# EasyEDA Pro project FKM3.epro, board OLD_LAYOUT
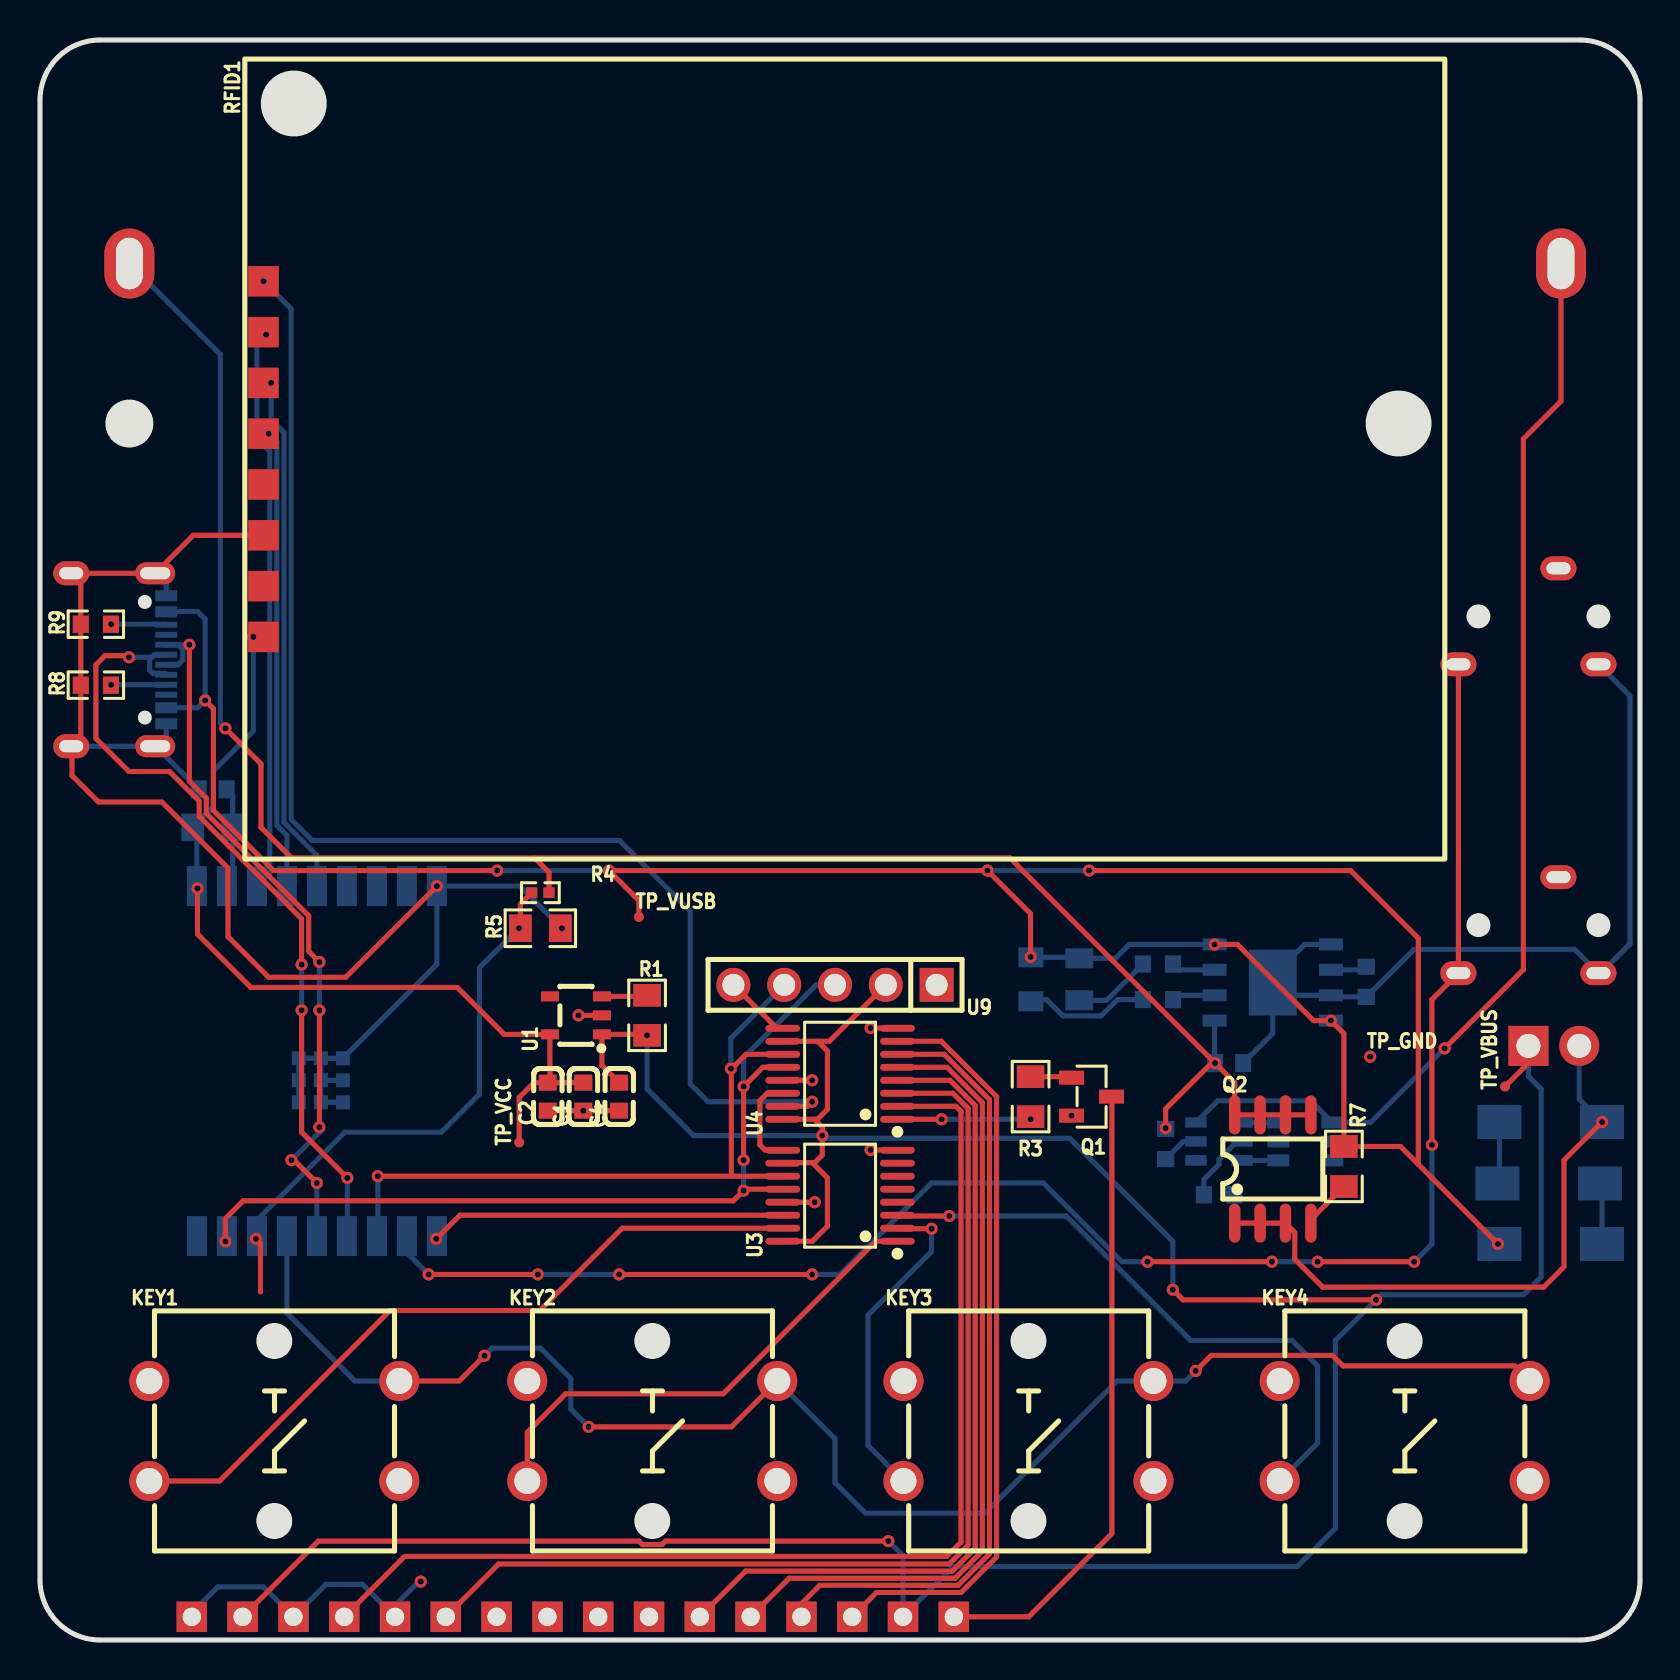
[diagram p11: board, top side]
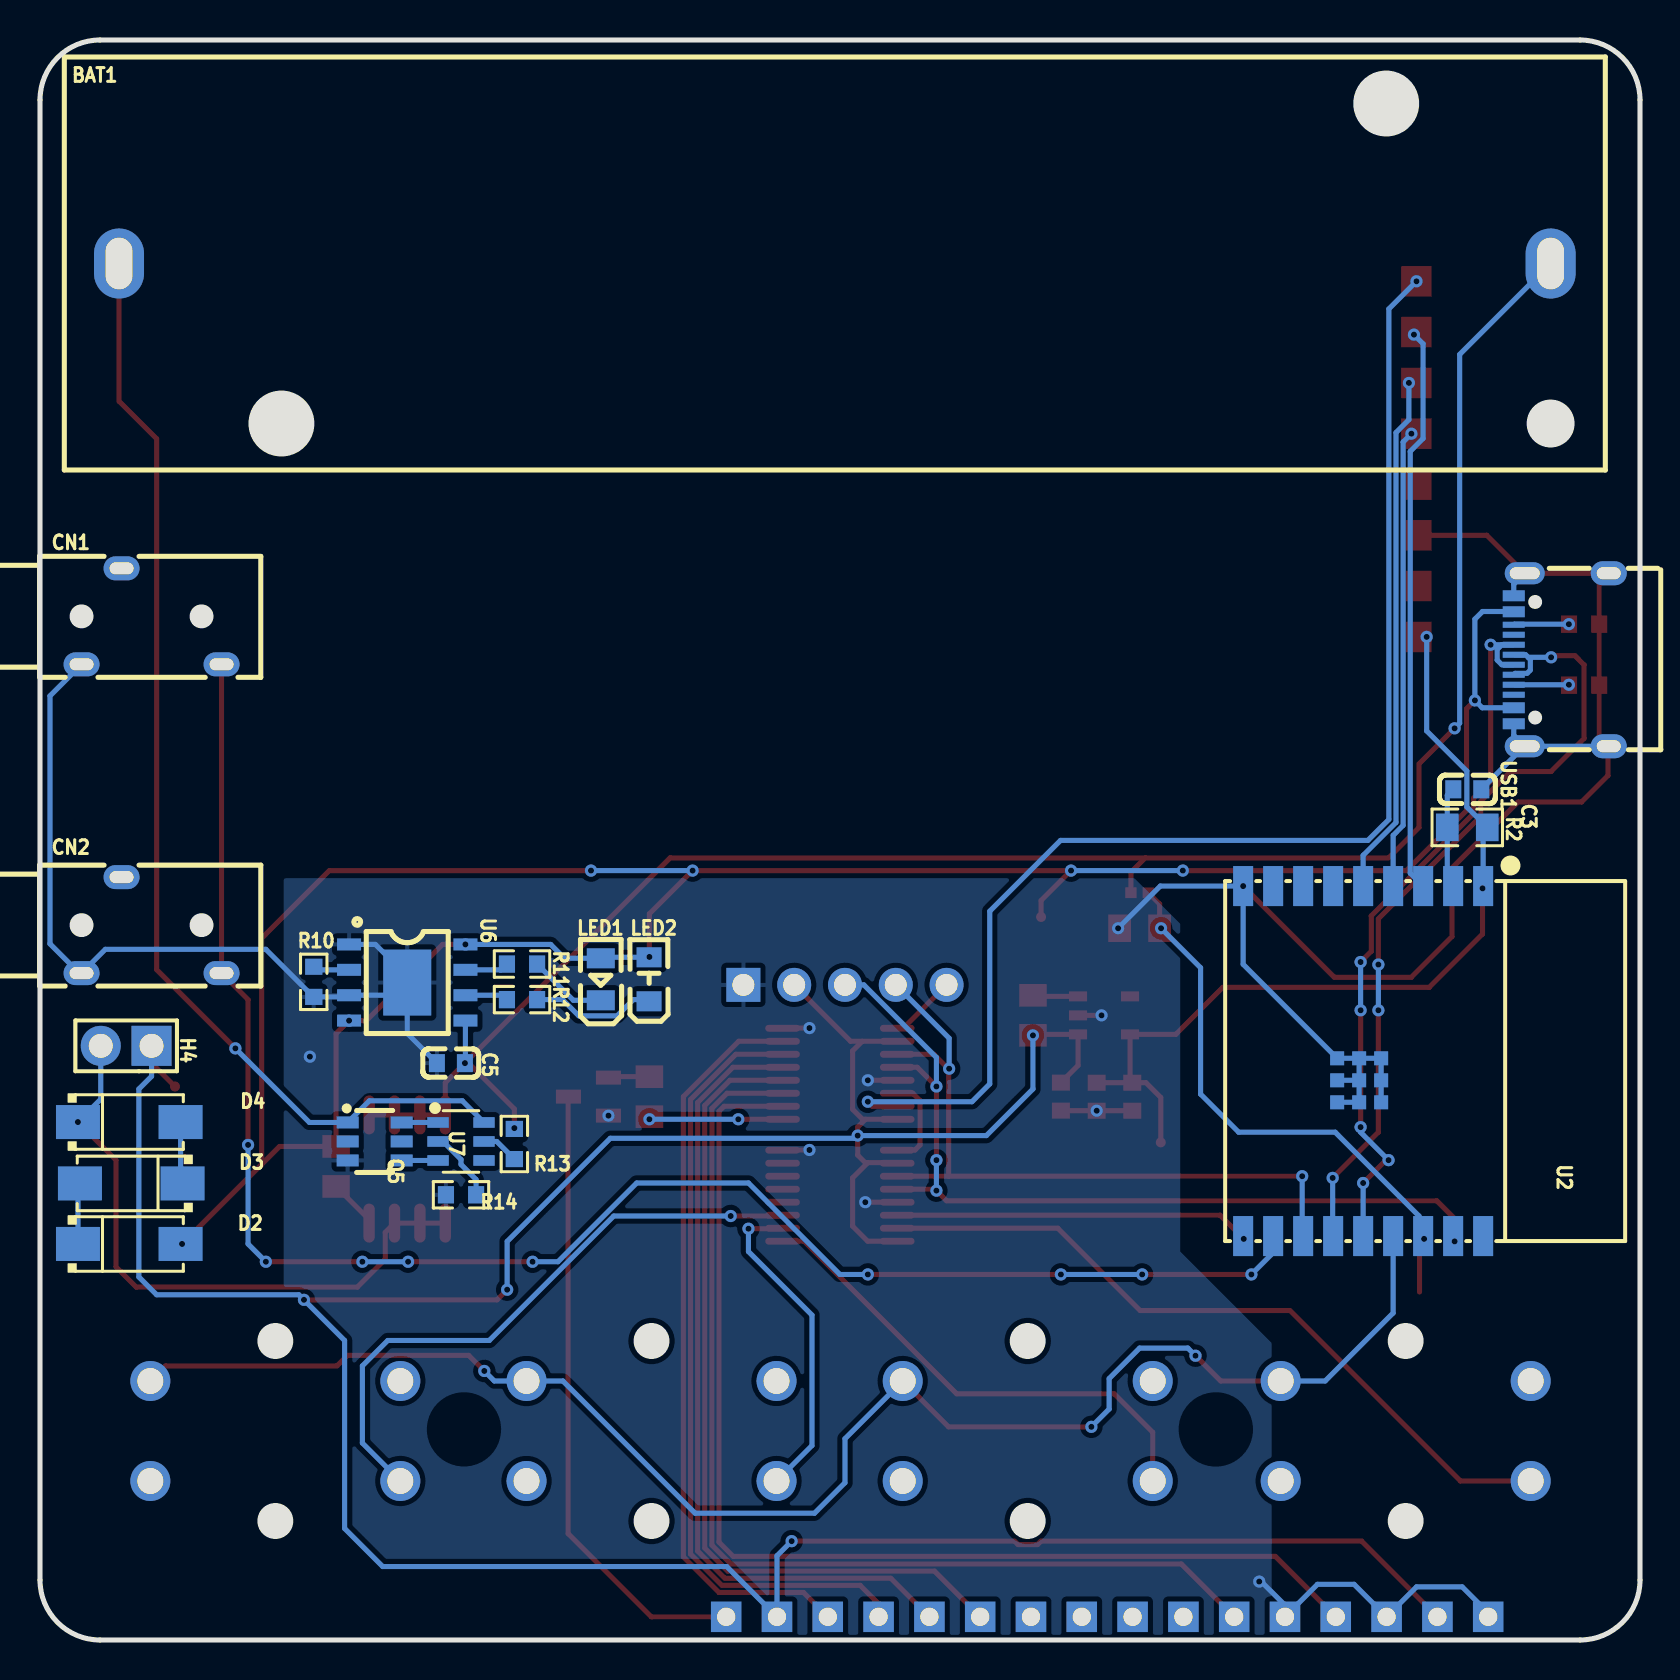
[diagram p12: board, bottom side, seen from below]

Outline 80 x 80 mm; copper layers: Top Layer, Bottom Layer. Coordinates in mm from the lower left corner of the outline.
Outline path: 0,77 0,3 arc(0.88,0.88) 3,0 77,0 arc(79.12,0.88) 80,3 80,77 arc(79.12,79.12) 77,80 3,80 arc(0.88,79.12) 0,77
Stack: Top Layer 0.035mm / Dielectric1 1.51mm FR4 er 4.5 / Bottom Layer 0.035mm

## Design rules (mm)
template: JLCPCB Capability(Two Layers Board)
spacing copperThickness1oz (default): track to track 0.102, other pairs 0.152 to 0.3
spacing copperThickness2oz: track to track 0.203, other pairs 0.152 to 0.3
track width copperThickness1oz (default): min 0.127, default 0.254, max 2.54
track width copperThickness2oz: min 0.203, default 0.254, max 2.54
differential pair differentialPair (default): width min 0.127, default 0.254, max 2.54; gap min 0.152, default 0.152
via viaSize (default): diameter min 0.5, default 0.61, max 10; hole min 0.3, default 0.305, max 6.3

## Placement (name value [footprint] x y rotation side)
BAT1  BH-18650-A6AJ003  [BAT-TH_BH-18650-A5BJ003]  40.26 68.82 180 bottom
C1  10uF  [C0603]  27.17 27.17 270 top
C2  100nF  [C0603]  25.39 27.17 270 top
C3  1uF  [C0603]  8.64 42.54 0 bottom
C4  10uF  [C0603]  28.96 27.17 270 top
C5  10uF  [C0603]  59.45 28.84 180 bottom
CN1  PJ-3200  [AUDIO-TH_PJ-3200]  74.42 51.18 180 bottom
CN2  PJ-3200  [AUDIO-TH_PJ-3200]  74.42 35.74 180 bottom
D2  SS14  [SMA_L4.2-W2.6-LS5.3-RD]  75.54 19.8 180 bottom
D3  SS14  [SMA_L4.2-W2.6-LS5.3-RD]  75.44 22.83 0 bottom
D4  SS14  [SMA_L4.2-W2.6-LS5.3-RD]  75.54 25.9 180 bottom
H1  -  [LCD16x2 edge connector]  7.59 1.16 0 top
H4  PW SWITCH  [HDR-TH_2P-P2.54-V-M]  75.69 29.71 0 bottom
KEY1  B3F-4055  [KEY-TH_4P-L12.0-W12.0-P5.00-LS13.4-EH]  11.72 10.45 0 top
KEY2  B3F-4055  [KEY-TH_4P-L12.0-W12.0-P5.00-LS13.4-EH]  30.61 10.45 0 top
KEY3  B3F-4055  [KEY-TH_4P-L12.0-W12.0-P5.00-LS13.4-EH]  49.42 10.45 0 top
KEY4  B3F-4055  [KEY-TH_4P-L12.0-W12.0-P5.00-LS13.4-EH]  68.23 10.45 0 top
LED1  KT-0805G  [LED0805-R-RD]  51.96 33.04 90 bottom
LED2  LTST-C170TBKT  [LED0805-RD_BLUE]  49.55 33.04 90 bottom
Q1  MMBT3904  [SOT-23-3_L2.9-W1.3-P1.90-LS2.4-BR]  52.58 27.17 180 top
Q2  AOSP21321  [SOIC-8_L5.0-W4.0-P1.27-LS6.0-BL]  61.64 23.55 0 top
Q5  FS8205A  [SOT-23-6_L2.9-W1.6-P0.95-LS2.8-BR]  63.27 24.93 0 bottom
R1  10kΩ  [R0805]  30.35 31.23 270 top
R2  10kΩ  [R0805]  8.64 40.63 0 bottom
R3  10kΩ  [R0805]  49.53 27.17 90 top
R4  6.8kΩ  [R0402]  25.02 37.37 180 top
R5  10kΩ  [R0805]  25.02 35.59 0 top
R7  10kΩ  [R0805]  65.2 23.68 270 top
R8  5100  [R0603]  2.79 47.74 0 top
R9  5100  [R0603]  2.79 50.79 0 top
R10  1.2k  [R0603]  66.31 32.91 270 bottom
R11  1k  [R0603]  55.9 33.8 0 bottom
R12  1k  [R0603]  55.9 32.02 0 bottom
R13  100  [R0603]  56.28 24.8 90 bottom
R14  1k  [R0603]  58.95 22.26 180 bottom
RFID1  -  [RFID-RC522-Board]  15.49 20.56 0 top
TP_GND  -  [Test-Point-0.5mm]  66.51 29.17 0 top
TP_VBUS  -  [Test-Point-0.5mm]  73.25 27.68 90 top
TP_VCC  -  [Test-Point-0.5mm]  23.96 24.88 90 top
TP_VUSB  -  [Test-Point-0.5mm]  29.95 36.15 0 top
U1  AP7366-33W5-7  [SOT-25_L3.0-W1.6-P0.95-LS2.8-BL]  26.8 31.23 90 top
U2  2.4GHz  [BULETM-SMD_ESPRESSIF_ESP32-C3-WROOM-02-N4-4MB]  13.84 28.95 270 bottom
U3  74HC595PW,118  [TSSOP-16_L5.0-W4.4-P0.65-LS6.4-BL]  40.01 22.22 90 top
U4  74HC595PW,118  [TSSOP-16_L5.0-W4.4-P0.65-LS6.4-BL]  40.01 28.31 90 top
U6  TP4056  [ESOP-8_L4.9-W3.9-P1.27-LS6.0-BL-EP]  61.64 32.87 270 bottom
U7  DW01A  [SOT-23-6_L2.9-W1.6-P0.95-LS2.8-BL]  58.95 24.93 270 bottom
U9  HB-PH3-25415PB2GOP  [HDR-TH_5P-P2.54-V-M]  39.75 32.76 180 top
USB1  TYPE-C 16PIN 2MD(073)  [USB-C-SMD_TYPE-C-6PIN-2MD-073]  3.94 49.01 90 bottom

## Footprints (pads in the part's own frame, mm; a bottom-side part is the same pattern mirrored in y, then rotated)
AUDIO-TH_PJ-3200
  oval 1.8x1.2 hole 1.2x0.6: 2(-1.5,2.4) 3(-3.5,-2.4) 4(3.5,-2.4)
BAT-TH_BH-18650-A5BJ003
  oval 2.5x3.5 hole 1.34x2.58: 1(-35.79,0) 2(35.79,0)
BULETM-SMD_ESPRESSIF_ESP32-C3-WROOM-02-N4-4MB
  rect 2x1 smd: 1(-8.75,6) 2(-8.75,4.5) 3(-8.75,3) 4(-8.75,1.5) 5(-8.75,0) 6(-8.75,-1.5) 7(-8.75,-3) 8(-8.75,-4.5) 9(-8.75,-6) 10(8.75,-6) 11(8.75,-4.5) 12(8.75,-3) 13(8.75,-1.5) 14(8.75,0) 15(8.75,1.5) 16(8.75,3) 17(8.75,4.5) 18(8.75,6)
  rect 0.7x0.7 smd: 19(-0.14,-1.3) 19(-0.14,-0.2) 19(-0.14,0.9) 19(0.96,-1.3) 19(0.96,-0.2) 19(0.96,0.9) 19(2.06,-1.3) 19(2.06,-0.2) 19(2.06,0.9)
C0603
  rect 0.8x0.9 smd: 1(-0.7,0) 2(0.7,0)
ESOP-8_L4.9-W3.9-P1.27-LS6.0-BL-EP
  rect 0.6x1.2 smd: 1(-1.905,-2.909) 2(-0.635,-2.909) 3(0.635,-2.909) 4(1.905,-2.909) 5(1.905,2.909) 6(0.635,2.909) 7(-0.635,2.909) 8(-1.905,2.909)
  rect 3.3x2.4 smd: 9(0,0)
HDR-TH_2P-P2.54-V-M
  rect 2x2 hole 1.2: 1(-1.27,0)
  round 2 hole 1.2: 2(1.27,0)
HDR-TH_5P-P2.54-V-M
  rect 1.7x1.7 hole 1.1: 1(-5.08,0)
  round 1.7 hole 1.1: 2(-2.54,0) 3(0,0) 4(2.54,0) 5(5.08,0)
KEY-TH_4P-L12.0-W12.0-P5.00-LS13.4-EH
  round 2 hole 1.3: 1(6.25,-2.5) 2(-6.25,-2.5) 3(6.25,2.5) 4(-6.25,2.5)
LCD16x2 edge connector
  rect 1.524x1.524 hole 0.914x0.914: 1(0,0) 3(5.08,0) 4(7.62,0) 5(10.16,0) 6(12.7,0) 7(15.24,0) 8(17.78,0) 9(20.32,0) 10(22.86,0) 11(25.4,0) 12(27.94,0) 13(30.48,0) 14(33.02,0) 15(35.56,0) 16(38.1,0)
  rect 1.524x1.524 hole 0.914x1: 2(2.54,0)
LED0805-R-RD
  rect 1x1.399 smd: 1(1.05,0) 2(-1.05,0)
LED0805-RD_BLUE
  rect 1x1.25 smd: 1(-1.1,0) 2(1.1,0)
R0402
  rect 0.566x0.54 smd: 1(-0.433,0) 2(0.433,0)
R0603
  rect 0.806x0.864 smd: 1(-0.753,0) 2(0.753,0)
R0805
  rect 1.133x1.377 smd: 1(-1,0) 2(1,0)
RFID-RC522-Board
  rect 1.524x1.524 smd: 1(-4.318,47.371) 2(-4.318,44.831) 3(-4.318,42.291) 4(-4.318,39.751) 5(-4.318,37.211) 6(-4.318,34.671) 7(-4.318,32.131) 8(-4.318,29.591)
SMA_L4.2-W2.6-LS5.3-RD
  rect 2.2x1.7 smd: 1(-2.566,0) 2(2.566,0)
SOIC-8_L5.0-W4.0-P1.27-LS6.0-BL
  oval 0.569x1.95 smd: 1(-1.905,-2.705) 2(-0.635,-2.705) 3(0.635,-2.705) 4(1.905,-2.705) 5(1.905,2.705) 6(0.635,2.705) 7(-0.635,2.705) 8(-1.905,2.705)
SOT-23-3_L2.9-W1.3-P1.90-LS2.4-BR
  rect 1.25x0.7 smd: 1(1,-0.95) 2(1,0.95) 3(-1,0)
SOT-23-6_L2.9-W1.6-P0.95-LS2.8-BL
  rect 0.532x1.072 smd: 1(-0.95,-1.149) 2(0,-1.149) 3(0.95,-1.149) 4(0.95,1.149) 5(0,1.149) 6(-0.95,1.149)
SOT-23-6_L2.9-W1.6-P0.95-LS2.8-BR
  rect 1.1x0.6 smd: 1(1.35,-0.95) 2(1.35,0) 3(1.35,0.95) 4(-1.35,0.95) 5(-1.35,0) 6(-1.35,-0.95)
SOT-25_L3.0-W1.6-P0.95-LS2.8-BL
  rect 0.5x0.9 smd: 1(-0.95,-1.3) 2(0,-1.3) 3(0.95,-1.3) 4(0.95,1.3) 5(-0.95,1.3)
Test-Point-0.5mm
  round 0.5 smd: 1(0,0)
TSSOP-16_L5.0-W4.4-P0.65-LS6.4-BL
  oval 0.343x1.732 smd: 1(-2.275,-2.866) 2(-1.625,-2.866) 3(-0.975,-2.866) 4(-0.325,-2.866) 5(0.325,-2.866) 6(0.975,-2.866) 7(1.625,-2.866) 8(2.275,-2.866) 9(2.275,2.866) 10(1.625,2.866) 11(0.975,2.866) 12(0.325,2.866) 13(-0.325,2.866) 14(-0.975,2.866) 15(-1.625,2.866) 16(-2.275,2.866)
USB-C-SMD_TYPE-C-6PIN-2MD-073
  rect 0.55x1.1 smd: 1(-3.2,2.375) 2(-2.4,2.375) 11(2.4,2.375) 12(3.2,2.375)
  rect 0.3x1.1 smd: 3(-1.75,2.375) 4(-1.25,2.375) 5(-0.75,2.375) 6(-0.25,2.375) 7(0.25,2.375) 8(0.75,2.375) 9(1.25,2.375) 10(1.75,2.375)
  oval 1.2x1.8 hole 0.6x1.2: 13(-4.325,-2.375) 14(4.325,-2.375)
  oval 1.1x2 hole 0.6x1.5: 13(-4.325,1.825) 14(4.325,1.825)

## Nets
GND: C1.2 C2.2 C3.1 C4.2 C5.1 CN1.3 CN2.3 H1.1 H1.3 H1.5 Q1.2 Q5.3 R5.2 R8.1 R9.1 R10.2 R14.1 RFID1.6 TP_GND.1 U1.2 U2.9 U2.19 U3.8 U3.13 U4.8 U4.13 U6.1 U6.3 U6.9 U9.1 USB1.1 USB1.12 USB1.13 USB1.14
VBUS: C4.1 H1.2 H1.15 H4.1 R1.2 TP_VBUS.1 U1.1 U3.10 U3.16 U4.10 U4.16 U9.2
VCC: C1.1 C2.1 R2.1 RFID1.8 TP_VCC.1 U1.5 U2.1
B+: BAT1.2 C5.2 Q2.5 Q2.6 Q2.7 Q2.8 R4.1 R13.2 U6.5
B-: BAT1.1 Q5.1 U7.6
BAT_SENS: R4.2 R5.1 U2.16
BTN_1: KEY1.2 U3.15
BTN_2: KEY2.2 U3.1
BTN_3: KEY3.2 U3.2
BTN_4: KEY4.2 U3.3
BTN_INP: KEY1.3 KEY2.3 KEY3.3 KEY4.3 U2.15
JACK: CN1.4 CN2.4 U2.11
LCD_BL: R3.1 U4.1
LCD_D4: H1.11 U4.4
LCD_D5: H1.12 U4.5
LCD_D6: H1.13 U4.6
LCD_D7: H1.14 U4.7
LCD_E: H1.6 U4.3
LCD_RS: H1.4 U4.2
S_DS: U2.10 U3.14
S_OUT: U4.9 U9.5
S_SHCP: U2.12 U3.11 U4.11 U9.4
S_STCP: U2.17 U3.12 U4.12 U9.3
SPI_CS: RFID1.1 U4.15
SPI_MISO: RFID1.4 U2.4
SPI_MOSI: RFID1.3 U2.5
SPI_SCK: RFID1.2 U2.3
USB_D+: U2.14 USB1.6 USB1.8
USB_D-: U2.13 USB1.5 USB1.7
VUSB: D2.2 LED1.1 LED2.2 R7.1 TP_VUSB.1 U6.4 U6.8 USB1.2 USB1.11
$1N383: R1.1 U1.3
$1N953: C3.2 R2.2 U2.2
$1N7305: U3.9 U4.14
$2N3153: Q1.1 R3.2
$2N3159: H1.16 Q1.3
$3N541: D4.1 H4.2 Q2.1 Q2.2 Q2.3
$3N542: Q2.4 R7.2
$3N546: D2.1 D3.2
$3N547: D3.1 D4.2
$3N796: R9.2 USB1.10
$3N800: R8.2 USB1.4
$3N1470: R13.1 U7.5
$3N1480: R11.2 U6.7
$3N1483: R12.2 U6.6
$3N1491: R10.1 U6.2
$3N1585: R14.2 U7.2
$3N1604: Q5.4 U7.3
$3N1608: Q5.6 U7.1
$3N3082: LED1.2 R11.1
$3N3173: LED2.1 R12.1

Pads without a net: CN1 2; CN2 2; H1 7 8 9 10; KEY1 1 4; KEY2 1 4; KEY3 1 4; KEY4 1 4; Q5 2 5; RFID1 5 7; U1 4; U2 6 7 8 18; U3 4 5 6 7; U7 4; USB1 3 9

## Via types
v1: diameter 0.61, hole 0.305, Top Layer to Bottom Layer, 74 vias

## Routing (per net, layer and track width the routed paths; a pad name or vN(x,y) marks a point on that pad's centre or on a via; arc(x,y) is an arc through that point)
GND: length 152.5
  Top Layer w0.254: U4.13 v1(38.61,27.99) ; v1(19.84,37.7) 15.28,33.14 11.43,33.14 9.4,35.17 9.4,38.6 6.1,41.9 2.92,41.9 1.6,43.22 1.6,44.65 USB1.13 2.04,45.17 R8.1 R9.1 2.04,52.86 USB1.14 USB1.14 7.66,55.24 10.8,55.24 ; U3.8 42.86,24.5 v1(41.53,24.5) ; v1(41.53,30.6) 42.86,30.6 U4.8 ; C2.2 v1(27.17,26.47) 28.95,26.47 C4.2 ; 28.1,31.23 v1(26.92,31.23) ; U3.13 v1(38.73,21.89)
  Bottom Layer w0.254: U2.19 U2.19 U2.19 ; C5.1 61.64,30.33 U6.9 ; U2.19 U2.19 19.84,33.79 v1(19.84,37.7) 23.99,37.7 v1(26.09,35.59) ; U2.19 U2.19 U2.19 U2.19 ; U2.19 U2.19 ; U6.1 63.23,34.78 61.64,33.19 U6.9 ; USB1.13 5.78,44.69 C3.1 ; USB1.13 USB1.13 ; USB1.13 6.31,45.24 USB1.1 ; USB1.14 6.31,52.79 USB1.12 ; 77.92,48.78 79.5,47.2 79.5,34.81 78.04,33.34 CN2.3 76.73,34.53 68.71,34.53 66.29,32.12 ; U6.9 62.27,32.24 U6.3 64.63,32.16 R10.2 ; H1.1 7.59,1.36 8.89,2.66 11.17,2.66 H1.3 14.3,2.78 16.13,2.78 17.75,1.16 17.75,1.74 18.92,2.91 19.03,2.91 v1(19.04,2.92) ; U2.19 U2.19
  vias: v1(51.58,26.22) v1(66.51,29.17)
VBUS: length 168.8
  Top Layer w0.254: U3.10 37.17,23.87 38.61,23.87 ; 38.72,26.04 39.12,25.64 v1(39.12,25.22) 39.12,24.25 38.73,23.87 38.61,23.87 ; 38.72,26.04 U4.16 ; 38.72,26.04 38.87,26.04 39.37,26.53 39.37,29.45 38.89,29.94 ; 38.61,23.87 39.37,23.1 39.37,20.69 38.62,19.94 U3.16 ; v1(42.42,4.94) 31.27,4.94 31.1,4.77 30.13,4.77 29.95,4.94 13.92,4.94 H1.2 ; TP_VBUS.1 74.42,28.84 H4.1 ; C4.1 28.1,28.73 28.1,30.28 29.8,30.28 29.85,30.23 ; 42.29,32.76 39.47,29.94 38.89,29.94 ; 38.89,29.94 U4.10 ; v1(66.8,17.01) 57.15,17.01 v1(56.64,17.52)
  Bottom Layer w0.254: v1(30.35,30.23) 30.35,27.55 32.68,25.22 v1(39.12,25.22) 39.25,25.09 51.49,25.09 56.64,19.93 v1(56.64,17.52) ; v1(42.42,4.94) 43.15,4.21 H1.15 45.67,3.67 62.86,3.67 64.77,5.58 64.77,14.98 v1(66.8,17.01) 67.06,17.26 74.17,17.26 75.06,18.15 75.06,27.55 74.42,28.18 H4.1
VCC: length 44.1
  Top Layer w0.254: C2.1 C1.1 ; C2.1 25.5,27.97 U1.5 23.21,30.28 20.86,32.63 10.54,32.63 7.87,35.3 v1(7.87,37.58) ; C2.1 24.7,27.87 23.96,27.13 TP_VCC.1
  Bottom Layer w0.254: v1(10.67,50.16) 10.67,45.46 8.66,43.45 8.66,41.65 R2.1 7.84,40.42 7.84,37.57
B+: length 98.9
  Top Layer w0.254: 24.73,39.11 25.45,38.39 R4.1 ; 24.73,39.11 12.57,39.11 11.05,40.63 11.05,43.81 v1(9.27,45.58) ; 24.73,39.11 48.49,39.11 v1(58.75,28.84) ; v1(56.28,25.6) 56.28,26.55 58.57,28.84 v1(58.75,28.84) ; Q2.5 Q2.6 Q2.7 Q2.8 59.73,27.86 v1(58.75,28.84)
  Bottom Layer w0.254: U6.5 58.73,28.87 v1(58.75,28.84) ; BAT1.2 9.02,64.28 9.02,45.84 v1(9.27,45.58)
B-: length 56.5
  Top Layer w0.254: BAT1.1 76.05,61.94 74.17,60.06 74.17,33.52 v1(70.23,29.58)
  Bottom Layer w0.254: v1(70.23,29.58) 66.53,25.88 Q5.1 63.54,26.96 58.88,26.96 U7.6
BAT_SENS: length 28.4
  Top Layer w0.254: R4.2 24.02,36.8 R5.1 ; 11.02,17.4 11.02,19.83 v1(10.8,20.06)
  Bottom Layer w0.254: v1(23.95,35.59) 21.97,33.61 21.97,27.3 20.07,25.39 15.24,25.39 11.05,21.2 11.05,20.4 U2.16
BTN_1: length 36.9
  Top Layer w0.254: KEY1.2 8.98,7.95 17.5,16.47 24.99,16.47 29.11,20.59 U3.15
BTN_2: length 24.9
  Top Layer w0.254: U3.1 41.79,19.94 34.16,12.31 26.29,12.31 24.36,10.38 KEY2.2
BTN_3: length 16.4
  Top Layer w0.254: v1(44.58,20.56) 42.9,20.56 U3.2
  Bottom Layer w0.254: KEY3.2 41.4,9.72 41.4,16.25 44.58,19.42 v1(44.58,20.56)
BTN_4: length 30.7
  Top Layer w0.254: U3.3 42.91,21.2 v1(45.47,21.2)
  Bottom Layer w0.254: v1(45.47,21.2) 51.31,21.2 57.54,14.98 62.61,14.98 63.88,13.71 63.88,9.85 KEY4.2
BTN_INP: length 79.2
  Top Layer w0.254: v1(22.23,14.21) 20.96,12.95 KEY1.3 ; v1(27.43,10.66) 34.57,10.66 KEY2.3 ; KEY4.3 73.73,13.71 65.15,13.71 64.63,14.23 58.56,14.23 v1(57.79,13.45)
  Bottom Layer w0.254: v1(57.79,13.45) 57.28,12.95 KEY3.3 53.85,12.95 47.24,6.34 41.27,6.34 39.75,7.86 39.75,10.06 KEY2.3 ; v1(27.43,10.66) 26.54,11.55 26.54,13.07 25.02,14.59 22.61,14.59 v1(22.23,14.21) ; KEY1.3 15.74,12.95 12.34,16.35 12.34,20.07
JACK: length 86
  Top Layer w0.254: v1(69.6,24.76) 69.6,32.02 CN2.4 70.92,48.78 ; v1(19.43,18.28) v1(24.89,18.28) ; v1(68.71,18.91) v1(63.88,18.91) ; v1(61.6,18.91) v1(55.37,18.91) ; v1(28.96,18.28) v1(38.61,18.28)
  Bottom Layer w0.254: v1(63.88,18.91) v1(61.6,18.91) ; v1(55.37,18.91) 54.1,18.91 50.17,22.85 44.58,22.85 40.01,18.28 v1(38.61,18.28) ; v1(19.43,18.28) 18.34,19.37 U2.11 ; v1(69.6,24.76) 69.6,19.8 v1(68.71,18.91) ; v1(24.89,18.28) v1(28.96,18.28)
LCD_BL: length 6.7
  Top Layer w0.254: U4.1 v1(45.08,26.04)
  Bottom Layer w0.254: v1(45.08,26.04) v1(49.53,26.04)
LCD_D4: length 41.7
  Top Layer w0.254: U4.4 45.5,27.99 46.76,26.73 46.76,4.6 45.61,3.44 35.28,3.44 H1.11
LCD_D5: length 40.4
  Top Layer w0.254: H1.12 37.46,3.09 45.76,3.09 47.12,4.45 47.12,26.87 45.36,28.64 U4.5
LCD_D6: length 39.3
  Top Layer w0.254: U4.6 45.21,29.29 47.47,27.02 47.47,4.3 45.9,2.73 38.99,2.73 38.07,1.81 H1.13
LCD_D7: length 37.6
  Top Layer w0.254: H1.14 41.83,2.38 46.05,2.38 47.83,4.15 47.83,27.17 45.06,29.94 U4.7
LCD_E: length 53.3
  Top Layer w0.254: H1.6 22.93,3.8 45.46,3.8 46.41,4.74 46.41,26.58 45.65,27.34 U4.3
LCD_RS: length 57.2
  Top Layer w0.254: H1.4 18.23,4.18 45.34,4.18 46.05,4.89 46.05,26.43 45.8,26.69 U4.2
S_DS: length 17.8
  Top Layer w0.254: v1(19.81,20.06) 21,21.24 U3.14
S_OUT: length 3.4
  Top Layer w0.254: 34.67,32.76 36.84,30.59 U4.9
S_SHCP: length 36.9
  Top Layer w0.254: 34.57,23.19 v1(16.89,23.19) ; 34.57,23.19 37.14,23.19 ; 34.57,23.19 34.57,28.55 35.31,29.29 U4.11
  Bottom Layer w0.254: v1(16.89,23.19) 16.89,20.12 16.84,20.07 ; v1(34.54,28.57) 34.54,30.09 U9.4
S_STCP: length 44.7
  Top Layer w0.254: U4.12 36.14,28.64 v1(35.18,27.68) v1(35.18,23.99) ; v1(9.27,19.93) 9.27,21.07 10.16,21.96 34.67,21.96 v1(35.18,22.47) 35.25,22.54 U3.12
  Bottom Layer w0.254: U9.3 38.81,32.76 35.18,29.13 v1(35.18,27.68) ; v1(35.18,23.99) v1(35.18,22.47)
SPI_CS: length 66
  Top Layer w0.254: v1(38.61,26.91) 38.38,26.69 U4.15
  Bottom Layer w0.254: v1(38.61,26.91) 33.4,26.91 32.51,27.8 32.51,36.44 28.97,39.98 13.61,39.98 12.56,41.03 12.56,66.55 v1(11.18,67.94)
SPI_MISO: length 23
  Bottom Layer w0.254: v1(11.43,60.32) 11.84,59.9 11.84,40.73 12.34,40.23 U2.4
SPI_MOSI: length 26.1
  Bottom Layer w0.254: U2.5 13.84,39.23 12.2,40.88 12.2,60.37 11.56,61.02 v1(11.56,62.86)
SPI_SCK: length 28.3
  Bottom Layer w0.254: v1(11.3,65.27) 10.85,64.81 10.85,60.07 11.49,59.43 11.49,38.34 U2.3
USB_D+: length 37
  Top Layer w0.254: v1(13.97,31.49) v1(13.97,25.64) ; v1(7.47,49.76) 7.47,42.94 8.32,42.09 8.32,41.33 13.44,36.21 13.44,34.43 v1(13.97,33.9) ; v1(13.84,22.85) 12.7,23.99 v1(12.57,23.99)
  Bottom Layer w0.254: 6.91,49.76 6.89,49.77 6.32,49.77 USB1.8 6.91,49.76 ; 6.91,49.76 v1(7.47,49.76) ; 6.91,49.76 7.14,49.53 7.14,49 6.91,48.76 USB1.6 ; v1(13.97,33.9) v1(13.97,31.49) ; v1(13.97,25.64) 13.97,25.39 v1(12.57,23.99) ; v1(13.84,22.85) U2.14
USB_D-: length 40.4
  Top Layer w0.254: v1(15.37,23.1) 13.08,25.39 v1(13.08,31.49) ; v1(13.08,33.77) 13.08,36.06 7.96,41.18 7.96,41.94 6.48,43.42 4.45,43.42 2.79,45.08 2.79,48.76 3.25,49.22 4.37,49.22 v1(4.45,49.14)
  Bottom Layer w0.254: U2.13 15.37,20.22 v1(15.37,23.1) ; 5.59,49.14 v1(4.45,49.14) ; 5.59,49.14 5.48,49.03 5.48,48.5 5.65,48.33 6.24,48.33 USB1.5 ; 5.59,49.14 5.72,49.26 USB1.7 ; v1(13.08,33.77) v1(13.08,31.49)
VUSB: length 129.5
  Top Layer w0.254: v1(8.26,46.98) 8.67,46.56 8.67,41.47 11.67,38.47 v1(22.86,38.47) ; v1(49.53,34.15) 49.53,36.31 v1(47.37,38.47) v1(28.45,38.47) 29.95,36.97 TP_VUSB.1 ; v1(58.73,34.78) 59.87,34.78 63.68,30.97 v1(64.55,30.97) 65.2,30.32 R7.1 68.02,24.68 68.91,23.79 ; 68.91,23.79 68.91,35.09 65.53,38.47 v1(52.45,38.47) ; 68.91,23.79 v1(72.9,19.8)
  Bottom Layer w0.254: v1(22.86,38.47) v1(28.45,38.47) ; v1(58.73,34.78) 54.47,34.78 53.77,34.09 LED1.1 51.91,34.14 LED2.2 ; USB1.11 6.33,51.43 7.87,51.43 8.26,51.04 v1(8.26,46.98) 7.89,46.61 USB1.2 ; v1(47.37,38.47) v1(52.45,38.47)
$1N383: length 1.8
  Top Layer w0.254: 28.1,32.18 29.8,32.18 29.85,32.23
$1N953: length 5.2
  Bottom Layer w0.254: C3.2 9.64,42.24 R2.2 9.64,37.86 9.34,37.57
$1N7305: length 4.8
  Top Layer w0.254: U3.9 37.13,24.5 36.25,24.5 35.99,24.75 35.99,26.97 36.36,27.34 U4.14
$2N3153: length 2.1
  Top Layer w0.254: Q1.1 51.53,28.17 R3.2
$2N3159: length 31.5
  Top Layer w0.254: H1.16 49.43,1.16 53.59,5.32 53.59,27.15 Q1.3
$3N541: length 31.3
  Top Layer w0.254: v1(78.11,25.9) 76.2,23.99 76.2,18.66 75.18,17.64 64.14,17.64 62.74,19.04 62.74,20.38 Q2.3 Q2.2 Q2.1
  Bottom Layer w0.254: H4.2 76.96,27.04 v1(78.11,25.9)
$3N542: length 2.6
  Top Layer w0.254: Q2.4 63.45,20.94 R7.2
$3N546: length 3.1
  Bottom Layer w0.254: D3.2 78.1,22.73 78.1,19.8
$3N547: length 3.1
  Bottom Layer w0.254: D4.2 72.97,22.93 D3.1
$3N796: length 2.8
  Bottom Layer w0.254: v1(3.56,50.79) 6.28,50.79 USB1.10
$3N800: length 2.8
  Bottom Layer w0.254: USB1.4 v1(3.56,47.76)
$3N1470: length 1.9
  Bottom Layer w0.254: R13.1 57.16,24.93 U7.5
$3N1480: length 2.2
  Bottom Layer w0.254: U6.7 56.94,33.51 R11.2
$3N1483: length 2.2
  Bottom Layer w0.254: R12.2 56.87,32.24 U6.6
$3N1491: length 1.8
  Bottom Layer w0.254: R10.1 66.16,33.51 U6.2
$3N1585: length 3.6
  Bottom Layer w0.254: R14.2 58.2,23.02 58.95,23.78 58.95,24.02 59.85,24.93 U7.2
$3N1604: length 1.8
  Bottom Layer w0.254: Q5.4 U7.3
$3N1608: length 1.8
  Bottom Layer w0.254: U7.1 Q5.6
$3N3082: length 3.9
  Bottom Layer w0.254: LED1.2 53.33,31.99 R11.1
$3N3173: length 6.3
  Bottom Layer w0.254: R12.1 53.87,32.02 53.06,31.21 51.15,31.21 50.33,32.02 49.63,32.02 LED2.1

## Copper pours and planes (outline as drawn; the poured copper is in the pictures)
GND on Bottom Layer: 18.42,0 67.81,0 67.82,-0.01 67.82,38.09 25.27,38.09 22.99,35.8 22.99,19.42 18.42,14.85
